# EAGLE schematic waves_v20 (EAGLE 9.6.2)

## Sheet 1 of 2
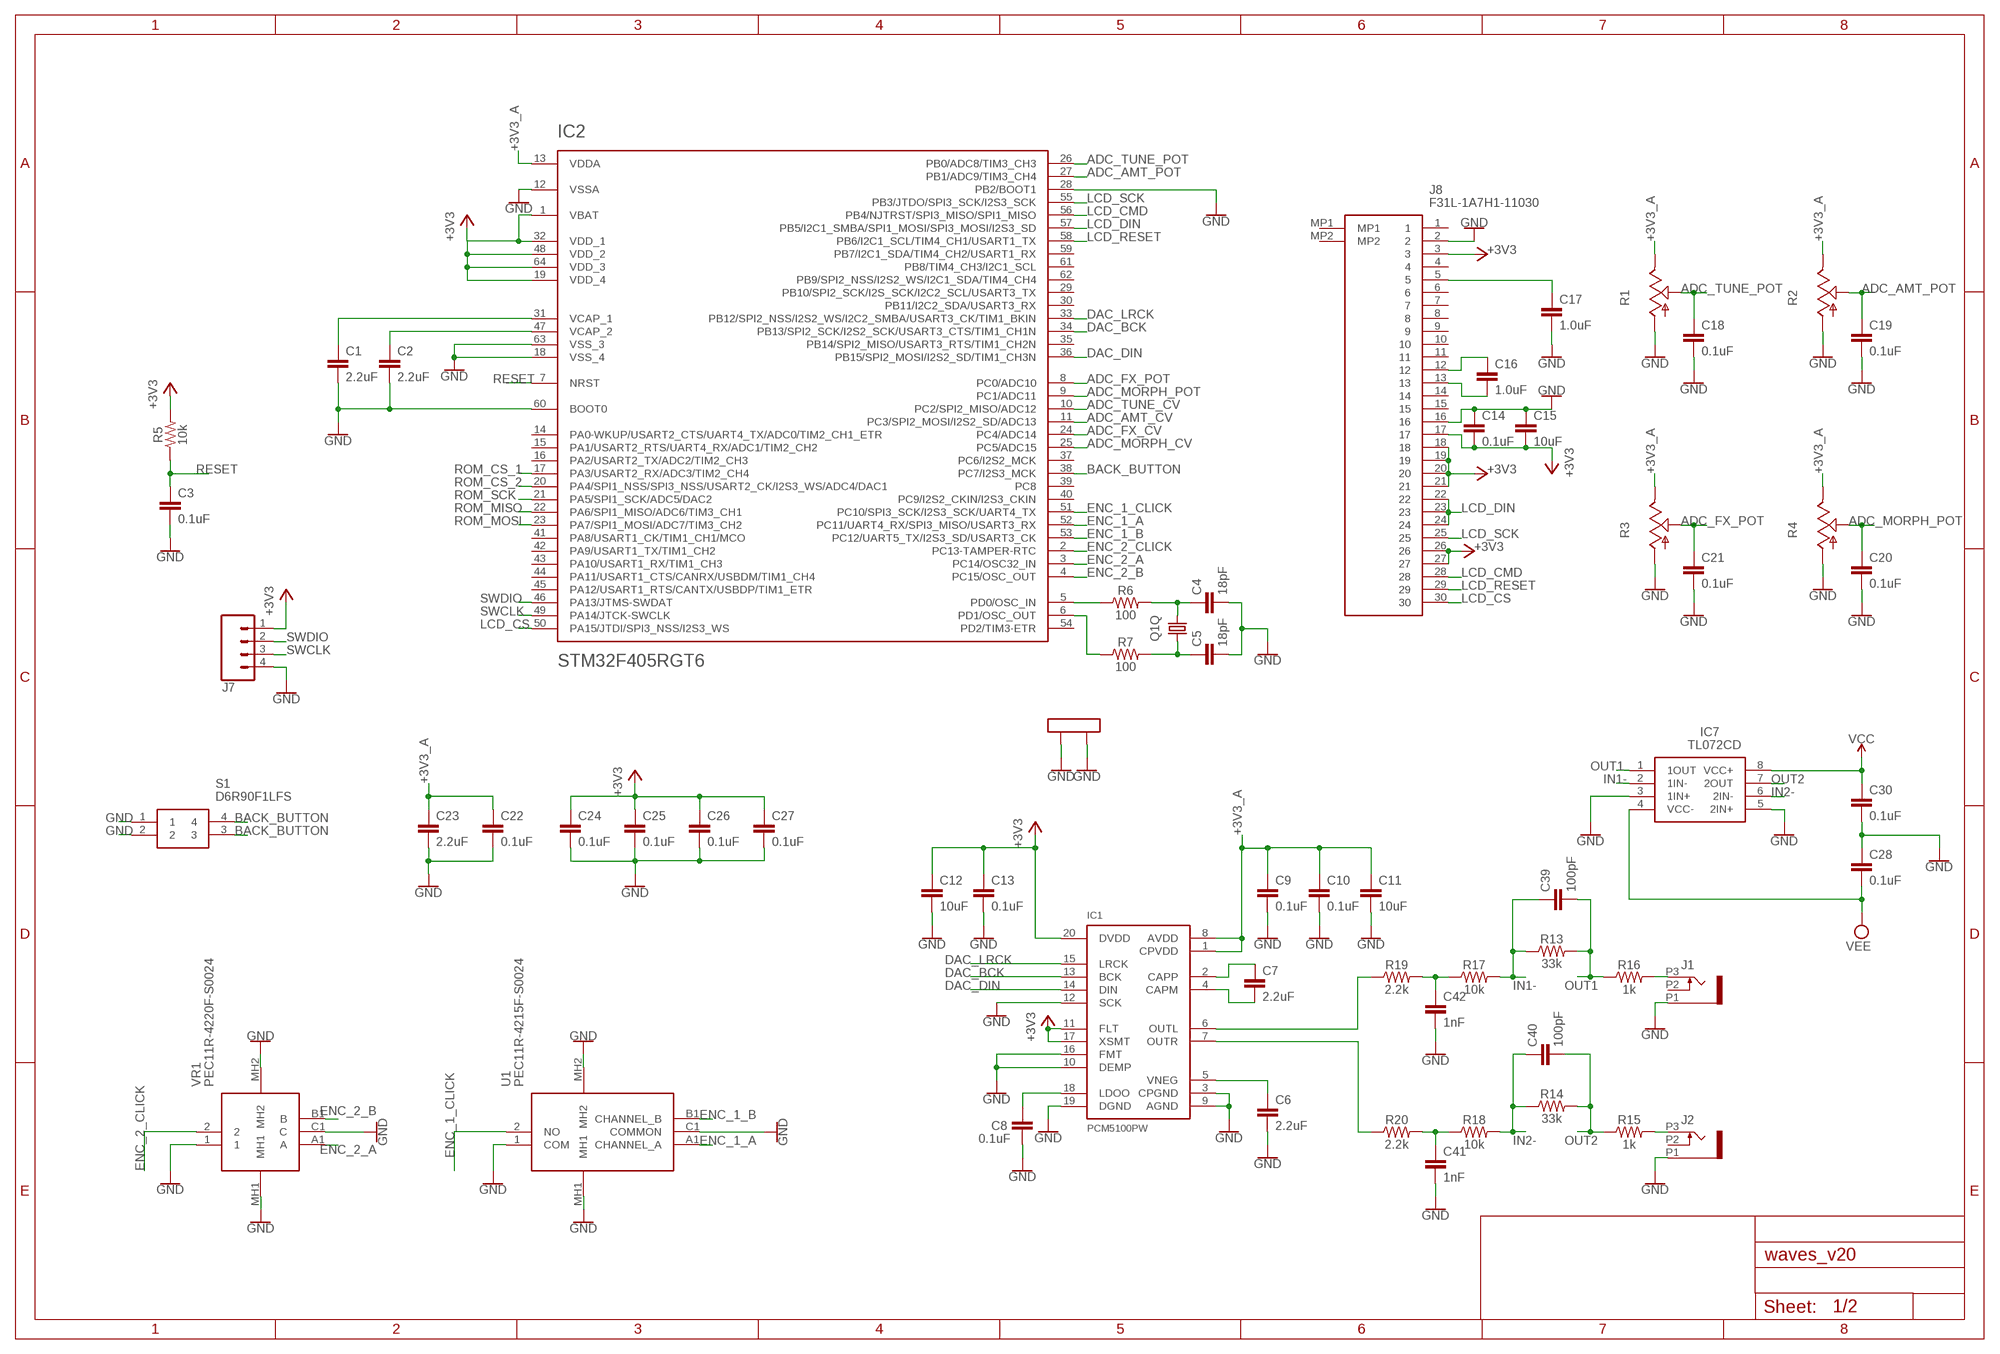
[diagram p0: schematic, sheet 1]

### Parts
C1  2.2uF  2.2UF-0603-10V-20%  [0603]
C2  2.2uF  2.2UF-0603-10V-20%  [0603]
C3  0.1uF  0.1UF-0603-25V-(+80/-20%)  [0603]
C4  18pF  18PF-0603-50V-5%  [0603]
C5  18pF  18PF-0603-50V-5%  [0603]
C6  2.2uF  2.2UF-0603-10V-20%  [0603]
C7  2.2uF  2.2UF-0603-10V-20%  [0603]
C8  0.1uF  0.1UF-0603-25V-(+80/-20%)  [0603]
C9  0.1uF  0.1UF-0603-25V-(+80/-20%)  [0603]
C10  0.1uF  0.1UF-0603-25V-(+80/-20%)  [0603]
C11  10uF  10UF-0603-6.3V-20%  [0603]
C12  10uF  10UF-0603-6.3V-20%  [0603]
C13  0.1uF  0.1UF-0603-25V-(+80/-20%)  [0603]
C14  0.1uF  0.1UF-0603-25V-(+80/-20%)  [0603]
C15  10uF  10UF-0603-6.3V-20%  [0603]
C16  1.0uF  1.0UF-0603-16V-10%  [0603]
C17  1.0uF  1.0UF-0603-16V-10%  [0603]
C18  0.1uF  0.1UF-0603-25V-(+80/-20%)  [0603]
C19  0.1uF  0.1UF-0603-25V-(+80/-20%)  [0603]
C20  0.1uF  0.1UF-0603-25V-(+80/-20%)  [0603]
C21  0.1uF  0.1UF-0603-25V-(+80/-20%)  [0603]
C22  0.1uF  0.1UF-0603-25V-(+80/-20%)  [0603]
C23  2.2uF  2.2UF-0603-10V-20%  [0603]
C24  0.1uF  0.1UF-0603-25V-(+80/-20%)  [0603]
C25  0.1uF  0.1UF-0603-25V-(+80/-20%)  [0603]
C26  0.1uF  0.1UF-0603-25V-(+80/-20%)  [0603]
C27  0.1uF  0.1UF-0603-25V-(+80/-20%)  [0603]
C28  0.1uF  0.1UF-0603-25V-(+80/-20%)  [0603]
C30  0.1uF  0.1UF-0603-25V-(+80/-20%)  [0603]
C39  100pF  100PF-0603-50V-5%  [0603]
C40  100pF  100PF-0603-50V-5%  [0603]
C41  1nF  1.0NF/1000PF-0603-50V-10%  [0603]
C42  1nF  1.0NF/1000PF-0603-50V-10%  [0603]
IC1  PCM5100PW  [SSOP20]
IC2  STM32F405RGT6  STM32F20X  [TQFP-10X10-64]
IC7  TL072CD  [SOIC127P600X175-8N]
J1  PJ301_THONKICONN6  [WQP_PJ_301M6]
J2  PJ301_THONKICONN6  [WQP_PJ_301M6]
J7  CONN_04  [1X04]
J8  F31L-1A7H1-11030  [F31L1A7H111030]
Q1  CRYSTAL  [CTS406]
R1  POT_USVERTICAL_PS  [ALPS_POT_VERTICAL_PS]
R2  POT_USVERTICAL_PS  [ALPS_POT_VERTICAL_PS]
R3  POT_USVERTICAL_PS  [ALPS_POT_VERTICAL_PS]
R4  POT_USVERTICAL_PS  [ALPS_POT_VERTICAL_PS]
R5  10k  10KOHM-0603-1/10W-1%  [0603]
R6  100  100OHM-0603-1/10W-1%  [0603]
R7  100  100OHM-0603-1/10W-1%  [0603]
R13  33k  33KOHM-0603-1/10W-1%  [0603]
R14  33k  33KOHM-0603-1/10W-1%  [0603]
R15  1k  1KOHM-0603-1/10W-1%  [0603]
R16  1k  1KOHM-0603-1/10W-1%  [0603]
R17  10k  10KOHM-0603-1/10W-1%  [0603]
R18  10k  10KOHM-0603-1/10W-1%  [0603]
R19  2.2k  2.2KOHM-0603-1/10W-1%  [0603]
R20  2.2k  2.2KOHM-0603-1/10W-1%  [0603]
S1  D6R90F1LFS  [D6C10F1LFS]
U1  PEC11R-4215F-S0024  [PEC11R4215FS0024]
VR1  PEC11R-4220F-S0024  [PEC11R4220FS0024]

### Nets
+3V3: C12.1 C13.1 C14.2 C15.2 C24.1 C25.1 C26.1 C27.1 IC1.11(FLT) IC1.17(XSMT) IC1.20(DVDD) IC2.1(VBAT) IC2.19(VDD_4) IC2.32(VDD_1) IC2.48(VDD_2) IC2.64(VDD_3) J7.1 J8.3 J8.17 J8.18 J8.19 J8.20 J8.21 J8.26 J8.27 R5.2 ; also sheet 2
+3V3_A: C9.1 C10.1 C11.1 C22.1 C23.1 IC1.1(CPVDD) IC1.8(AVDD) IC2.13(VDDA) R1.P$1(E) R2.P$1(E) R3.P$1(E) R4.P$1(E) ; also sheet 2
ADC_AMT_CV: IC2.11(PC3/SPI2_MOSI/I2S2_SD/ADC13) ; also sheet 2
ADC_AMT_POT: C19.1 IC2.27(PB1/ADC9/TIM3_CH4) R2.P$2(S)
ADC_FX_CV: IC2.24(PC4/ADC14) ; also sheet 2
ADC_FX_POT: C21.1 IC2.8(PC0/ADC10) R3.P$2(S)
ADC_MORPH_CV: IC2.25(PC5/ADC15) ; also sheet 2
ADC_MORPH_POT: C20.1 IC2.9(PC1/ADC11) R4.P$2(S)
ADC_TUNE_CV: IC2.10(PC2/SPI2_MISO/ADC12) ; also sheet 2
ADC_TUNE_POT: C18.1 IC2.26(PB0/ADC8/TIM3_CH3) R1.P$2(S)
BACK_BUTTON: IC2.38(PC7/I2S3_MCK) S1.3 S1.4
DAC_BCK: IC1.13(BCK) IC2.34(PB13/SPI2_SCK/I2S2_SCK/USART3_CTS/TIM1_CH1N)
DAC_DIN: IC1.14(DIN) IC2.36(PB15/SPI2_MOSI/I2S2_SD/TIM1_CH3N)
DAC_LRCK: IC1.15(LRCK) IC2.33(PB12/SPI2_NSS/I2S2_WS/I2C2_SMBA/USART3_CK/TIM1_BKIN)
ENC_1_A: IC2.52(PC11/UART4_RX/SPI3_MISO/USART3_RX) U1.A1(CHANNEL_A)
ENC_1_B: IC2.53(PC12/UART5_TX/I2S3_SD/USART3_CK) U1.B1(CHANNEL_B)
ENC_1_CLICK: IC2.51(PC10/SPI3_SCK/I2S3_SCK/UART4_TX) U1.2(NO)
ENC_2_A: IC2.3(PC14/OSC32_IN) VR1.A1(A)
ENC_2_B: IC2.4(PC15/OSC_OUT) VR1.B1(B)
ENC_2_CLICK: IC2.2(PC13-TAMPER-RTC) VR1.2
GND: C1.2 C2.2 C3.2 C4.2 C5.2 C6.2 C8.2 C9.2 C10.2 C11.2 C12.2 C13.2 C14.1 C15.1 C17.2 C18.2 C19.2 C20.2 C21.2 C22.2 C23.2 C24.2 C25.2 C26.2 C27.2 C28.1 C30.2 C41.2 C42.2 IC1.3(CPGND) IC1.9(AGND) IC1.10(DEMP) IC1.12(SCK) IC1.16(FMT) IC1.19(DGND) IC2.12(VSSA) IC2.18(VSS_4) IC2.28(PB2/BOOT1) IC2.60(BOOT0) IC2.63(VSS_3) IC7.3(1IN+) IC7.5(2IN+) J1.P1 J2.P1 J7.4 J8.2 J8.16 Q1.2(LID1) Q1.4(LID2) R1.P$3(A) R2.P$3(A) R3.P$3(A) R4.P$3(A) S1.1 S1.2 U1.1(COM) U1.C1(COMMON) U1.MH1 U1.MH2 VR1.1 VR1.C1(C) VR1.MH1 VR1.MH2 ; also sheet 2
IN1-: C39.1 IC7.2(1IN-) R13.1 R17.2
IN2-: C40.1 IC7.6(2IN-) R14.1 R18.2
LCD_CMD: IC2.56(PB4/NJTRST/SPI3_MISO/SPI1_MISO) J8.28
LCD_CS: IC2.50(PA15/JTDI/SPI3_NSS/I2S3_WS) J8.30
LCD_DIN: IC2.57(PB5/I2C1_SMBA/SPI1_MOSI/SPI3_MOSI/I2S3_SD) J8.22 J8.23 J8.24
LCD_RESET: IC2.58(PB6/I2C1_SCL/TIM4_CH1/USART1_TX) J8.29
LCD_SCK: IC2.55(PB3/JTDO/SPI3_SCK/I2S3_SCK) J8.25
N$1: C1.1 IC2.31(VCAP_1)
N$2: C2.1 IC2.47(VCAP_2)
N$3: C17.1 J8.5
N$4: C6.1 IC1.5(VNEG)
N$5: C8.1 IC1.18(LDOO)
N$6: C7.1 IC1.2(CAPP)
N$7: C4.1 Q1.3 R6.2
N$8: IC2.6(PD1/OSC_OUT) R7.1
N$9: IC2.5(PD0/OSC_IN) R6.1
N$10: C5.1 Q1.1 R7.2
N$11: C7.2 IC1.4(CAPM)
N$12: C16.2 J8.13
N$13: C16.1 J8.12
N$14: IC1.6(OUTL) R19.1
N$19: IC1.7(OUTR) R20.1
N$32: J2.P3 R15.2
N$33: J1.P3 R16.2
N$34: C42.1 R17.1 R19.2
N$35: C41.1 R18.1 R20.2
OUT1: C39.2 IC7.1(1OUT) R13.2 R16.1
OUT2: C40.2 IC7.7(2OUT) R14.2 R15.1
RESET: C3.1 IC2.7(NRST) R5.1
ROM_CS_1: IC2.17(PA3/USART2_RX/ADC3/TIM2_CH4) ; also sheet 2
ROM_CS_2: IC2.20(PA4/SPI1_NSS/SPI3_NSS/USART2_CK/I2S3_WS/ADC4/DAC1) ; also sheet 2
ROM_MISO: IC2.22(PA6/SPI1_MISO/ADC6/TIM3_CH1) ; also sheet 2
ROM_MOSI: IC2.23(PA7/SPI1_MOSI/ADC7/TIM3_CH2) ; also sheet 2
ROM_SCK: IC2.21(PA5/SPI1_SCK/ADC5/DAC2) ; also sheet 2
SWCLK: IC2.49(PA14/JTCK-SWCLK) J7.3
SWDIO: IC2.46(PA13/JTMS-SWDAT) J7.2
VCC: C30.1 IC7.8(VCC+) ; also sheet 2
VEE: C28.2 IC7.4(VCC-) ; also sheet 2
Unconnected: IC2.14(PA0-WKUP/USART2_CTS/UART4_TX/ADC0/TIM2_CH1_ETR) IC2.15(PA1/USART2_RTS/UART4_RX/ADC1/TIM2_CH2) IC2.16(PA2/USART2_TX/ADC2/TIM2_CH3) IC2.29(PB10/SPI2_SCK/I2S_SCK/I2C2_SCL/USART3_TX) IC2.30(PB11/I2C2_SDA/USART3_RX) IC2.35(PB14/SPI2_MISO/USART3_RTS/TIM1_CH2N) IC2.37(PC6/I2S2_MCK) IC2.39(PC8) IC2.40(PC9/I2S2_CKIN/I2S3_CKIN) IC2.41(PA8/USART1_CK/TIM1_CH1/MCO) IC2.42(PA9/USART1_TX/TIM1_CH2) IC2.43(PA10/USART1_RX/TIM1_CH3) IC2.44(PA11/USART1_CTS/CANRX/USBDM/TIM1_CH4) IC2.45(PA12/USART1_RTS/CANTX/USBDP/TIM1_ETR) IC2.54(PD2/TIM3-ETR) IC2.59(PB7/I2C1_SDA/TIM4_CH2/USART1_RX) IC2.61(PB8/TIM4_CH3/I2C1_SCL) IC2.62(PB9/SPI2_NSS/I2S2_WS/I2C1_SDA/TIM4_CH4) J1.P2 J2.P2 J8.1 J8.4 J8.6 J8.7 J8.8 J8.9 J8.10 J8.11 J8.14 J8.15 J8.MP1 J8.MP2

## Sheet 2 of 2
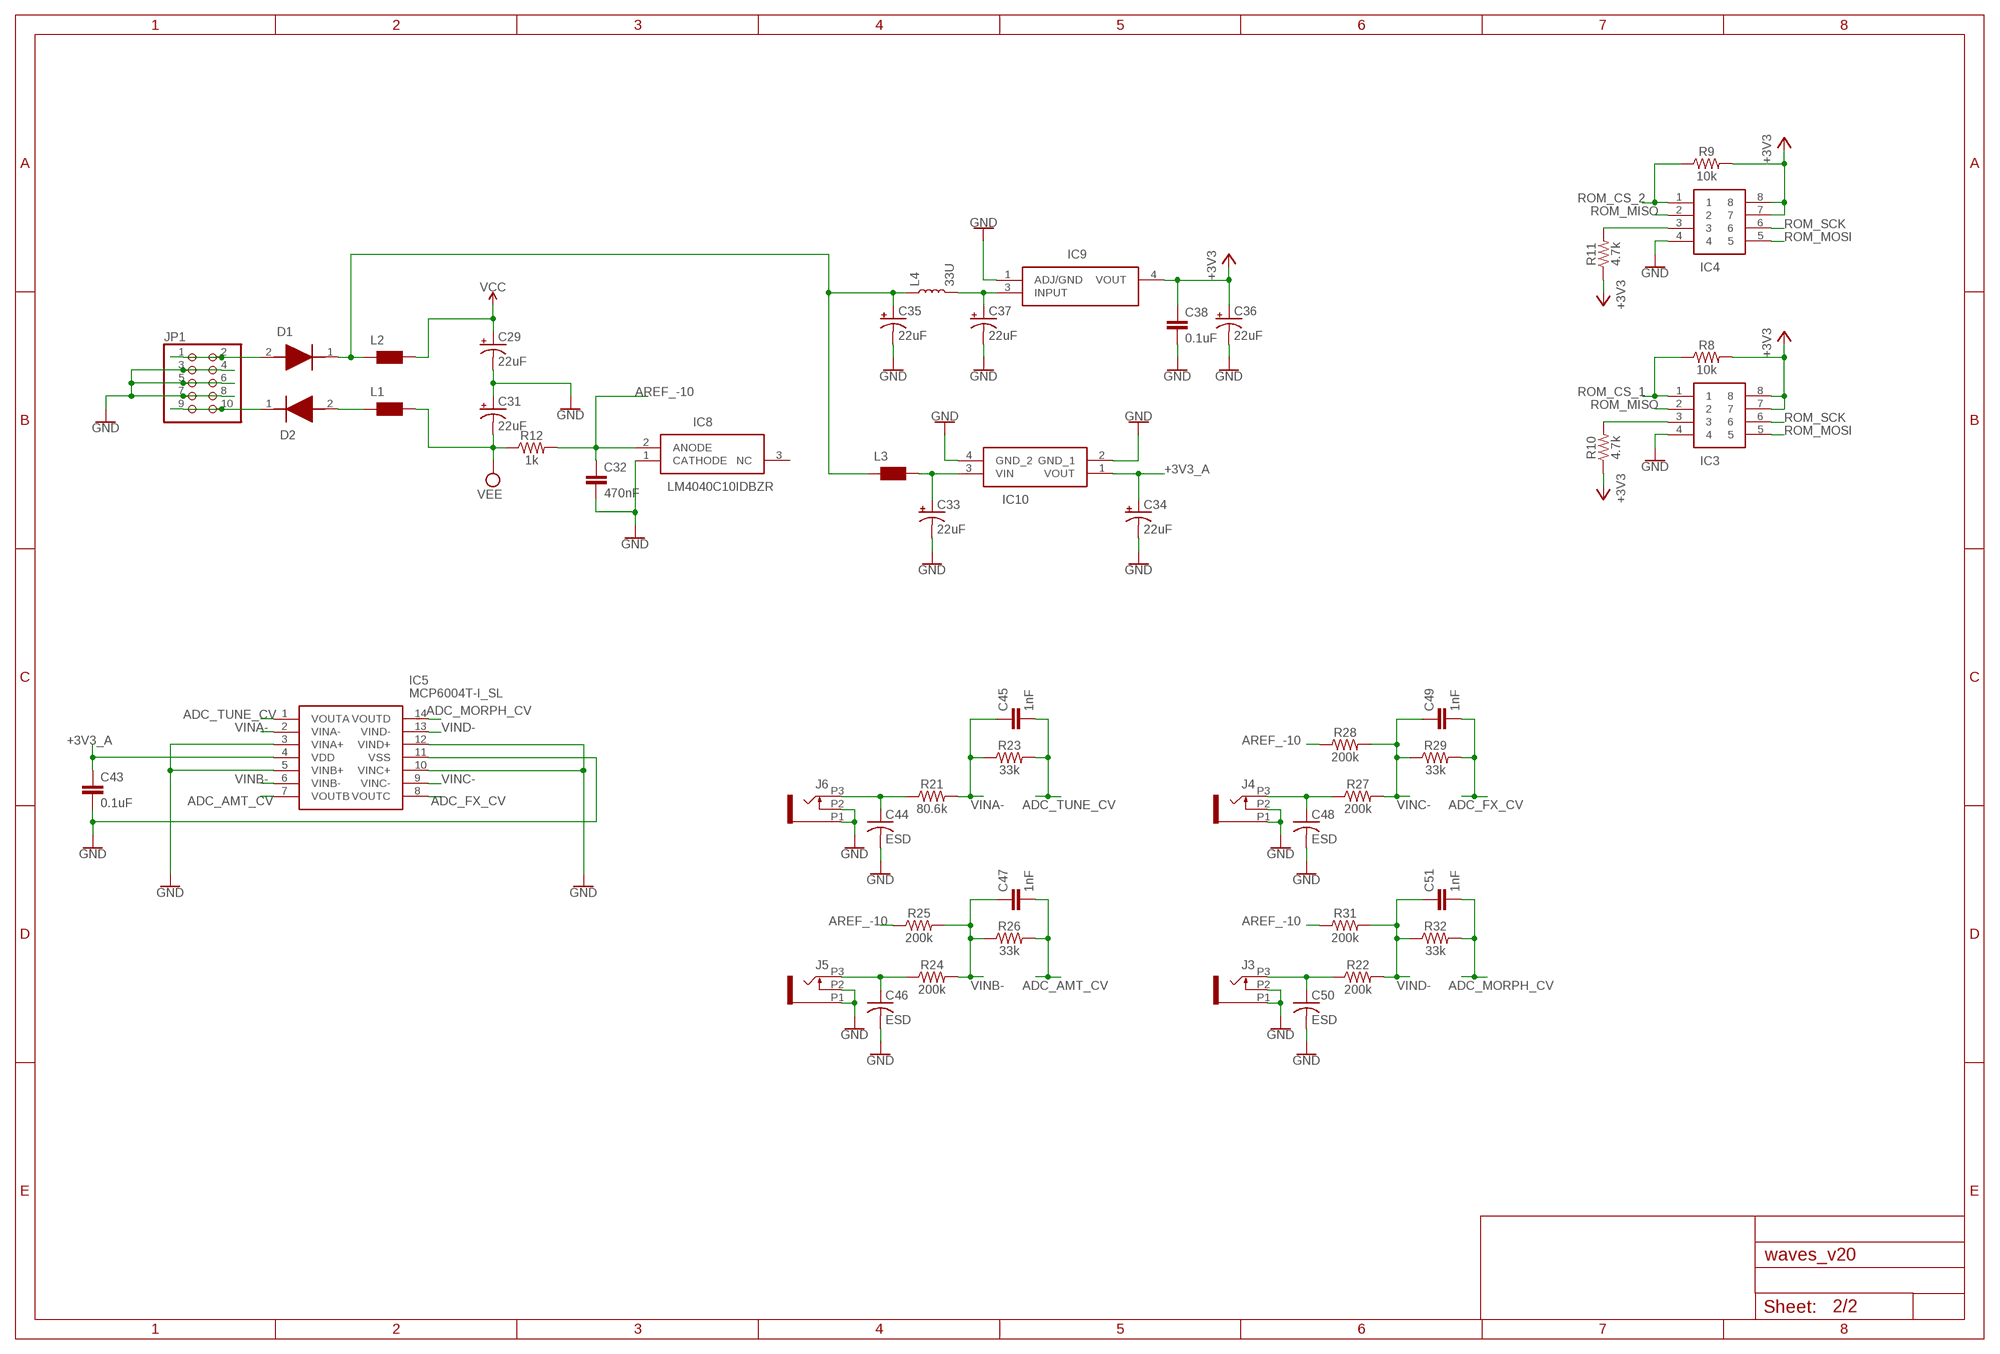
[diagram p1: schematic, sheet 2]

### Parts
C29  22uF  22UF-POLAR-PANASONIC_C-35V-20%  [PANASONIC_C]
C31  22uF  22UF-POLAR-PANASONIC_C-35V-20%  [PANASONIC_C]
C32  470nF  470NF-0402-16V-10%  [0402]
C33  22uF  22UF-POLAR-PANASONIC_C-35V-20%  [PANASONIC_C]
C34  22uF  22UF-POLAR-PANASONIC_C-35V-20%  [PANASONIC_C]
C35  22uF  22UF-POLAR-PANASONIC_C-35V-20%  [PANASONIC_C]
C36  22uF  22UF-POLAR-PANASONIC_C-35V-20%  [PANASONIC_C]
C37  22uF  22UF-POLAR-PANASONIC_C-35V-20%  [PANASONIC_C]
C38  0.1uF  0.1UF-0603-25V-(+80/-20%)  [0603]
C43  0.1uF  0.1UF-0603-25V-(+80/-20%)  [0603]
C44  ESD  C-USC0603  [C0603]
C45  1nF  1.0NF/1000PF-0603-50V-10%  [0603]
C46  ESD  C-USC0603  [C0603]
C47  1nF  1.0NF/1000PF-0603-50V-10%  [0603]
C48  ESD  C-USC0603  [C0603]
C49  1nF  1.0NF/1000PF-0603-50V-10%  [0603]
C50  ESD  C-USC0603  [C0603]
C51  1nF  1.0NF/1000PF-0603-50V-10%  [0603]
D1  1N5819HW-7-F  [SOD3716X145N]
D2  1N5819HW-7-F  [SOD3716X145N]
IC3  1-2199298-2  [DIPS762W70P254L1016H510Q8N]
IC4  1-2199298-2  [DIPS762W70P254L1016H510Q8N]
IC5  MCP6004T-I_SL  [SOIC127P600X175-14N]
IC8  LM4040C10IDBZR  [SOT95P237X112-3N]
IC9  LM1117DT-3.3_NOPB  [TO228P991X238-3N]
IC10  LD2981ABU33TR  [LD2981ABU33TR]
J3  PJ301_THONKICONN6  [WQP_PJ_301M6]
J4  PJ301_THONKICONN6  [WQP_PJ_301M6]
J5  PJ301_THONKICONN6  [WQP_PJ_301M6]
J6  PJ301_THONKICONN6  [WQP_PJ_301M6]
JP1  PINHD-2X5  [2X05]
L1  WE-CBF_0603  [0603]
L2  WE-CBF_0603  [0603]
L3  WE-CBF_0603  [0603]
L4  33U  INDUCTOR-0805-3.3UH  [0805]
R8  10k  10KOHM-0603-1/10W-1%  [0603]
R9  10k  10KOHM-0603-1/10W-1%  [0603]
R10  4.7k  4.7KOHM-0603-1/10W-1%  [0603]
R11  4.7k  4.7KOHM-0603-1/10W-1%  [0603]
R12  1k  1KOHM-0603-1/10W-1%  [0603]
R21  80.6k  82OHM-0603-1/10W-1%  [0603]
R22  200k  200KOHM-0603-1/10W-1%  [0603]
R23  33k  33KOHM-0603-1/10W-1%  [0603]
R24  200k  200KOHM-0603-1/10W-1%  [0603]
R25  200k  200KOHM-0603-1/10W-1%  [0603]
R26  33k  33KOHM-0603-1/10W-1%  [0603]
R27  200k  200KOHM-0603-1/10W-1%  [0603]
R28  200k  200KOHM-0603-1/10W-1%  [0603]
R29  33k  33KOHM-0603-1/10W-1%  [0603]
R31  200k  200KOHM-0603-1/10W-1%  [0603]
R32  33k  33KOHM-0603-1/10W-1%  [0603]

### Nets
+3V3: C36.+ C38.1 IC3.7 IC3.8 IC4.7 IC4.8 IC9.4(VOUT) R8.2 R9.2 R10.1 R11.1 ; also sheet 1
+3V3_A: C34.+ C43.1 IC5.4(VDD) IC10.1(VOUT) ; also sheet 1
ADC_AMT_CV: C47.2 IC5.7(VOUTB) R26.2 ; also sheet 1
ADC_FX_CV: C49.2 IC5.8(VOUTC) R29.2 ; also sheet 1
ADC_MORPH_CV: C51.2 IC5.14(VOUTD) R32.2 ; also sheet 1
ADC_TUNE_CV: C45.2 IC5.1(VOUTA) R23.2 ; also sheet 1
AREF_-10: C32.1 IC8.2(ANODE) R12.2 R25.1 R28.1 R31.1
GND: C29.- C31.+ C32.2 C33.- C34.- C35.- C36.- C37.- C38.2 C43.2 C44.2 C46.2 C48.2 C50.2 IC3.4 IC4.4 IC5.3(VINA+) IC5.5(VINB+) IC5.10(VINC+) IC5.11(VSS) IC5.12(VIND+) IC8.1(CATHODE) IC9.1(ADJ/GND) IC10.2(GND_1) IC10.4(GND_2) J3.P1 J3.P2 J4.P1 J4.P2 J5.P1 J5.P2 J6.P1 J6.P2 JP1.3 JP1.4 JP1.5 JP1.6 JP1.7 JP1.8 ; also sheet 1
N$15: C46.1 J5.P3 R24.1
N$16: C44.1 J6.P3 R21.1
N$17: C48.1 J4.P3 R27.1
N$18: D2.1(K) JP1.9 JP1.10
N$20: IC3.3 R10.2
N$21: D1.2(A) JP1.1 JP1.2
N$22: C35.+ D1.1(K) L2.1 L3.1 L4.1
N$23: C50.1 J3.P3 R22.1
N$24: D2.2(A) L1.1
N$25: C33.+ IC10.3(VIN) L3.2
N$26: IC4.3 R11.2
N$27: C37.+ IC9.3(INPUT) L4.2
ROM_CS_1: IC3.1 R8.1 ; also sheet 1
ROM_CS_2: IC4.1 R9.1 ; also sheet 1
ROM_MISO: IC3.2 IC4.2 ; also sheet 1
ROM_MOSI: IC3.5 IC4.5 ; also sheet 1
ROM_SCK: IC3.6 IC4.6 ; also sheet 1
VCC: C29.+ L2.2 ; also sheet 1
VEE: C31.- L1.2 R12.1 ; also sheet 1
VINA-: C45.1 IC5.2(VINA-) R21.2 R23.1
VINB-: C47.1 IC5.6(VINB-) R24.2 R25.2 R26.1
VINC-: C49.1 IC5.9(VINC-) R27.2 R28.2 R29.1
VIND-: C51.1 IC5.13(VIND-) R22.2 R31.2 R32.1
Unconnected: IC8.3(NC)

## Library data of the parts
C1 C2 C6 C7 C23 = SparkFun-Capacitors:2.2UF: 2.2µF ceramic capacitors A capacitor is a passive two-terminal electrical component used to store electrical energy temporarily in an electric field.; PROD_ID: CAP-07888
C3 C8-C10 C13 C14 C18-C22 C24-C28 C30 C38 C43 = SparkFun-Capacitors:0.1UF: 0.1µF ceramic capacitors A capacitor is a passive two-terminal electrical component used to store electrical energy temporarily in an electric field.; PROD_ID: CAP-00810
C4 C5 = SparkFun-Capacitors:18PF: 18pF ceramic capacitors A capacitor is a passive two-terminal electrical component used to store electrical energy temporarily in an electric field.; PROD_ID: CAP-08267
C11 C12 C15 = SparkFun-Capacitors:10UF: 10.0µF ceramic capacitors A capacitor is a passive two-terminal electrical component used to store electrical energy temporarily in an electric field.; PROD_ID: CAP-11015
C16 C17 = SparkFun-Capacitors:1.0UF: 1µF ceramic capacitors A capacitor is a passive two-terminal electrical component used to store electrical energy temporarily in an electric field.; PROD_ID: CAP-00868
C29 C31 C33-C37 = SparkFun-Capacitors:22UF-POLAR: 22µF polarized capacitors A capacitor is a passive two-terminal electrical component used to store electrical energy temporarily in an electric field.; PROD_ID: CAP-08618
C32 = SparkFun-Capacitors:470NF: 0.47uF/470nF ceramic capacitors A capacitor is a passive two-terminal electrical component used to store electrical energy temporarily in an electric field.; PROD_ID: CAP-09041
C39 C40 = SparkFun-Capacitors:100PF: 100pF/0.1nF ceramic capacitors A capacitor is a passive two-terminal electrical component used to store electrical energy temporarily in an electric field.; PROD_ID: CAP-07883
C41 C42 C45 C47 C49 C51 = SparkFun-Capacitors:1.0NF/1000PF: 1nF/1,000pF ceramic capacitors A capacitor is a passive two-terminal electrical component used to store electrical energy temporarily in an electric field.; PROD_ID: CAP-07886
C44 C46 C48 C50 = rcl:C-US: CAPACITOR, American symbol; SPICEPREFIX: C
D1 D2 = 1N5819HW-7-F:1N5819HW-7-F: Diode Schottky 1A 40V SOD123 Diodes Inc 1N5819HW-7-F, SMT Schottky Diode, 40V 1A, 2-Pin SOD-123 Source: Datasheet <https://datasheet.datasheetarchive.com/originals/distributors/Datasheets-DGA23/1390892.pdf>; DESCRIPTION: Diode Schottky 1A 40V SOD123 Diodes Inc 1N5819HW-7-F, SMT Schottky Diode, 40V 1A, 2-Pin SOD-123; HEIGHT: 1.45mm; MANUFACTURER_NAME: Diodes Inc.; MANUFACTURER_PART_NUMBER: 1N5819HW-7-F; MOUSER_PART_NUMBER: 621-1N5819HW-F; MOUSER_PRICE-STOCK: https://www.mouser.co.uk/ProductDetail/Diodes-Incorporated/1N5819HW-7-F?qs=NQ47qNm99eDyWTEd07miYA%3D%3D
IC1 = og-dac:PCM5100
IC2 = marbles_v70:STM32F20X
IC3 IC4 = 1-2199298-2:1-2199298-2: TE CONNECTIVITY - 1-2199298-2 - IC SOCKET, DIP, 8POS, TH Source: Datasheet <https://componentsearchengine.com/Datasheets/2/1-2199298-2.pdf>; DESCRIPTION: TE CONNECTIVITY - 1-2199298-2 - IC SOCKET, DIP, 8POS, TH; HEIGHT: 5.1mm; MANUFACTURER_NAME: TE Connectivity; MANUFACTURER_PART_NUMBER: 1-2199298-2; MOUSER_PART_NUMBER: 571-1-2199298-2; MOUSER_PRICE-STOCK: https://www.mouser.co.uk/ProductDetail/TE-Connectivity/1-2199298-2?qs=fK8dlpkaUMtEKa4wabwOXQ%3D%3D
IC5 = MCP6004T-I_SL:MCP6004T-I_SL: IC OPAMP QUAD 1.8V Source: Datasheet <https://datasheet.datasheetarchive.com/originals/distributors/Datasheets-DGA24/1612149.pdf>; DESCRIPTION: IC OPAMP QUAD 1.8V; HEIGHT: 1.75mm; MANUFACTURER_NAME: Microchip; MANUFACTURER_PART_NUMBER: MCP6004T-I/SL; MOUSER_PART_NUMBER: 579-MCP6004T-I/SL; MOUSER_PRICE-STOCK: https://www.mouser.co.uk/ProductDetail/Microchip-Technology/MCP6004T-I-SL?qs=Q%2Fw7XRh99ikP9NT9semfTQ%3D%3D
IC7 = TL072CD:TL072CD: Dual Low-Noise JFET-Input General-Purpose Operational Amplifier Source: Datasheet <http://www.ti.com/lit/ds/symlink/tl072.pdf>; DESCRIPTION: Dual Low-Noise JFET-Input General-Purpose Operational Amplifier; HEIGHT: 1.75mm; MANUFACTURER_NAME: Texas Instruments; MANUFACTURER_PART_NUMBER: TL072CD; MOUSER_PART_NUMBER: 595-TL072CD; MOUSER_PRICE-STOCK: https://www.mouser.co.uk/ProductDetail/Texas-Instruments/TL072CD?qs=5nGYs9Do7G0niDPig1J2Tw%3D%3D
IC8 = LM4040C10IDBZR:LM4040C10IDBZR: PRECISION MICROPOWER SHUNT VOLTAGE REFERENCE Source: Datasheet <http://www.ti.com/lit/gpn/lm4040>; DESCRIPTION: PRECISION MICROPOWER SHUNT VOLTAGE REFERENCE; HEIGHT: mm; MANUFACTURER_NAME: Texas Instruments; MANUFACTURER_PART_NUMBER: LM4040C10IDBZR; MOUSER_PART_NUMBER: 595-LM4040C10IDBZR; MOUSER_PRICE-STOCK: https://www.mouser.com/Search/Refine.aspx?Keyword=595-LM4040C10IDBZR
IC9 = LM1117DT-3.3_NOPB:LM1117DT-3.3_NOPB: Space saving 800-mA low-dropout linear regulator with internal current limit Source: Datasheet <https://datasheet.datasheetarchive.com/originals/distributors/Datasheets-SFU2/DSASFU100036103.pdf>; DESCRIPTION: Space saving 800-mA low-dropout linear regulator with internal current limit; HEIGHT: 2.38mm; MANUFACTURER_NAME: Texas Instruments; MANUFACTURER_PART_NUMBER: LM1117DT-3.3/NOPB; MOUSER_PART_NUMBER: 926-LM1117DT-3.3NOPB; MOUSER_PRICE-STOCK: https://www.mouser.co.uk/ProductDetail/Texas-Instruments/LM1117DT-3.3-NOPB?qs=X1J7HmVL2ZHOT670myqy2w%3D%3D
IC10 = LDO Voltage Regulators 3.3V:LD2981ABU33TR: LDO Regulator 3.3V 0.1A SOT89 Source: Datasheet <http://www.st.com/st-web-ui/static/active/en/resource/technical/document/datasheet/CD00001635.pdf>; DESCRIPTION: LDO Regulator 3.3V 0.1A SOT89; HEIGHT: 1.6mm; MANUFACTURER_NAME: STMicroelectronics; MANUFACTURER_PART_NUMBER: LD2981ABU33TR; MOUSER_PART_NUMBER: 511-LD2981ABU33; MOUSER_PRICE-STOCK: https://www.mouser.co.uk/ProductDetail/STMicroelectronics/LD2981ABU33TR?qs=1OhPZrgumbmBIvYeukN1Rg%3D%3D
J1-J6 = og-pj301:PJ301_THONKICONN: pj301 thonkiconn
J7 = SparkFun-Connectors:CONN_04: Multi connection point. Often used as Generic Header-pin footprint for 0.1 inch spaced/style header connections On any of the 0.1 inch spaced packages, you can populate with these: Break Away Headers - Straight <https://www.sparkfun.com/products/116> (PRT-00116) Break Away Male Headers - Right Angle <https://www.sparkfun.com/products/553> (PRT-00553) Female Headers <https://www.sparkfun.com/products/115> (PRT-00115) Break Away Headers - Machine Pin <https://www.sparkfun.com/products/117> (PRT-00117) Break Away Female Headers - Swiss Machine Pin <https://www.sparkfun.com/products/743> (PRT-00743) For SCREWTERMINALS and SPRING TERMINALS visit here: Screw Terimnals on SparkFun.com <https://www.sparkfun.com/search/results?term=Screw+Terminals> (5mm/3.5mm/2.54mm spacing) This device is also useful as a general connection point to wire up your design to another part of your project. Our various solder wires solder well into these plated through hole pads. Hook-Up Wire - Assortment (Stranded, 22 AWG) <https://www.sparkfun.com/products/11375> (PRT-11375) Hook-Up Wire - Assortment (Solid Core, 22 AWG) <https://www.sparkfun.com/products/11367> (PRT-11367) View the entire wire category on our website here <https://www.sparkfun.com/categories/141> Special notes: Molex polarized connector foot print use with SKU : PRT-08231 with associated crimp pins and housings. 1MM SMD Version SKU: PRT-10208; PROD_ID: CONN-09696
J8 = F31L-1A7H1-11030:F31L-1A7H1-11030: Flex Connector, 0.50mm Pitch, Height 2.55mm, Right angle, Flip type, ZIF, 30 position , With MYLAR Source: Datasheet <https://cdn.amphenol-cs.com/media/wysiwyg/files/drawing/a-s0099-lf31l.pdf>; DESCRIPTION: Flex Connector, 0.50mm Pitch, Height 2.55mm, Right angle, Flip type, ZIF, 30 position , With MYLAR; HEIGHT: 2.75mm; MANUFACTURER_NAME: Amphenol; MANUFACTURER_PART_NUMBER: F31L-1A7H1-11030; MOUSER_PART_NUMBER: 649-F31L-1A7H1-11030; MOUSER_PRICE-STOCK: https://www.mouser.co.uk/ProductDetail/Amphenol-Aorora/F31L-1A7H1-11030?qs=xZ%2FP%252Ba9zWqba3JhFjnTbQA%3D%3D
JP1 = pinhead:PINHD-2X5: PIN HEADER
L1-L3 = wuerth-elektronik:WE-CBF: SMD EMI Suppression Ferrite Beads - excellent anti-EMI properties - low DCR - impedances till 3000 ohms - rated current up to 6 A
L4 = SparkFun-Coils:INDUCTOR: Inductors Resist changes in electrical current. Basically a coil of wire. SparkFun Products: SparkFun Load Cell Amplifier - HX711 <https://www.sparkfun.com/products/13879> IOIO-OTG - V2.2 <https://www.sparkfun.com/products/13613>; PROD_ID: NDUC-13076; VALUE: 3.3µH/±20%/450mA
Q1 = og-crystal:CRYSTAL: Crystal with 2 extra terminals for the metal LID (Abracon ABMM2 for example)
R1-R4 = og-pots:POT_US
R5 R8 R9 R17 R18 = SparkFun-Resistors:10KOHM: 10kΩ resistor A resistor is a passive two-terminal electrical component that implements electrical resistance as a circuit element. Resistors act to reduce current flow, and, at the same time, act to lower voltage levels within circuits. - Wikipedia; PROD_ID: RES-00824
R6 R7 = SparkFun-Resistors:100OHM: 100Ω resistor A resistor is a passive two-terminal electrical component that implements electrical resistance as a circuit element. Resistors act to reduce current flow, and, at the same time, act to lower voltage levels within circuits. - Wikipedia; PROD_ID: RES-07863
R10 R11 = SparkFun-Resistors:4.7KOHM: 4.7kΩ resistor A resistor is a passive two-terminal electrical component that implements electrical resistance as a circuit element. Resistors act to reduce current flow, and, at the same time, act to lower voltage levels within circuits. - Wikipedia; PROD_ID: RES-07857
R12 R15 R16 = SparkFun-Resistors:1KOHM: 1kΩ resistor A resistor is a passive two-terminal electrical component that implements electrical resistance as a circuit element. Resistors act to reduce current flow, and, at the same time, act to lower voltage levels within circuits. - Wikipedia; PROD_ID: RES-07856
R13 R14 R23 R26 R29 R32 = SparkFun-Resistors:33KOHM: 33kΩ resistor A resistor is a passive two-terminal electrical component that implements electrical resistance as a circuit element. Resistors act to reduce current flow, and, at the same time, act to lower voltage levels within circuits. - Wikipedia; PROD_ID: RES-08416
R19 R20 = SparkFun-Resistors:2.2KOHM: 2.2kΩ resistor A resistor is a passive two-terminal electrical component that implements electrical resistance as a circuit element. Resistors act to reduce current flow, and, at the same time, act to lower voltage levels within circuits. - Wikipedia; PROD_ID: RES-08272
R21 = SparkFun-Resistors:82OHM: 82Ω resistor A resistor is a passive two-terminal electrical component that implements electrical resistance as a circuit element. Resistors act to reduce current flow, and, at the same time, act to lower voltage levels within circuits. - Wikipedia; PROD_ID: RES-12311; VALUE: 82
R22 R24 R25 R27 R28 R31 = SparkFun-Resistors:200KOHM: 200kΩ resistor A resistor is a passive two-terminal electrical component that implements electrical resistance as a circuit element. Resistors act to reduce current flow, and, at the same time, act to lower voltage levels within circuits. - Wikipedia; PROD_ID: RES-09385
S1 = D6R Push Button:D6R90F1LFS: D6R90F1LFS (Key Switches) Source: Datasheet <https://www.ckswitches.com/media/1341/d6.pdf>; DESCRIPTION: D6R90F1LFS (Key Switches); HEIGHT: mm; MANUFACTURER_NAME: C & K COMPONENTS; MANUFACTURER_PART_NUMBER: D6R90F1LFS; MOUSER_PART_NUMBER: 611-D6R90LFS; MOUSER_PRICE-STOCK: https://www.mouser.co.uk/ProductDetail/CK/D6R90F1LFS?qs=WS%2FiepCTwPDejJXcQ7Ir1g%3D%3D
U1 = PEC11R-4215F-S0024:PEC11R-4215F-S0024: Rotary Encoder Mechanical 24 Quadrature (Incremental) Vertical 15mm SHAFT w/SWITCH Source: Datasheet <https://www.bourns.com/docs/product-datasheets/pec11r.pdf?sfvrsn=bb617cbf_12>; DESCRIPTION: Rotary Encoder Mechanical 24 Quadrature (Incremental) Vertical 15mm SHAFT w/SWITCH; HEIGHT: 21.5mm; MANUFACTURER_NAME: Bourns; MANUFACTURER_PART_NUMBER: PEC11R-4215F-S0024; MOUSER_PART_NUMBER: 652-PEC11R-4215F-S24; MOUSER_PRICE-STOCK: https://www.mouser.co.uk/ProductDetail/Bourns/PEC11R-4215F-S0024?qs=Zq5ylnUbLm5lAqmKF80wzQ%3D%3D
VR1 = PEC11R-4220F-S0024:PEC11R-4220F-S0024: Bourns 24 Pulse Incremental Mechanical Rotary Encoder with a 6 mm Flat Shaft (Not Indexed), Through Hole Source: Datasheet <https://www.bourns.com/docs/Product-Datasheets/PEC11R.pdf>; DESCRIPTION: Bourns 24 Pulse Incremental Mechanical Rotary Encoder with a 6 mm Flat Shaft (Not Indexed), Through Hole; HEIGHT: 27.5mm; MANUFACTURER_NAME: Bourns; MANUFACTURER_PART_NUMBER: PEC11R-4220F-S0024; MOUSER_PART_NUMBER: 652-PEC11R-4220F-S24; MOUSER_PRICE-STOCK: https://www.mouser.co.uk/ProductDetail/Bourns/PEC11R-4220F-S0024?qs=Zq5ylnUbLm6NGsQdib%2Ffbw%3D%3D